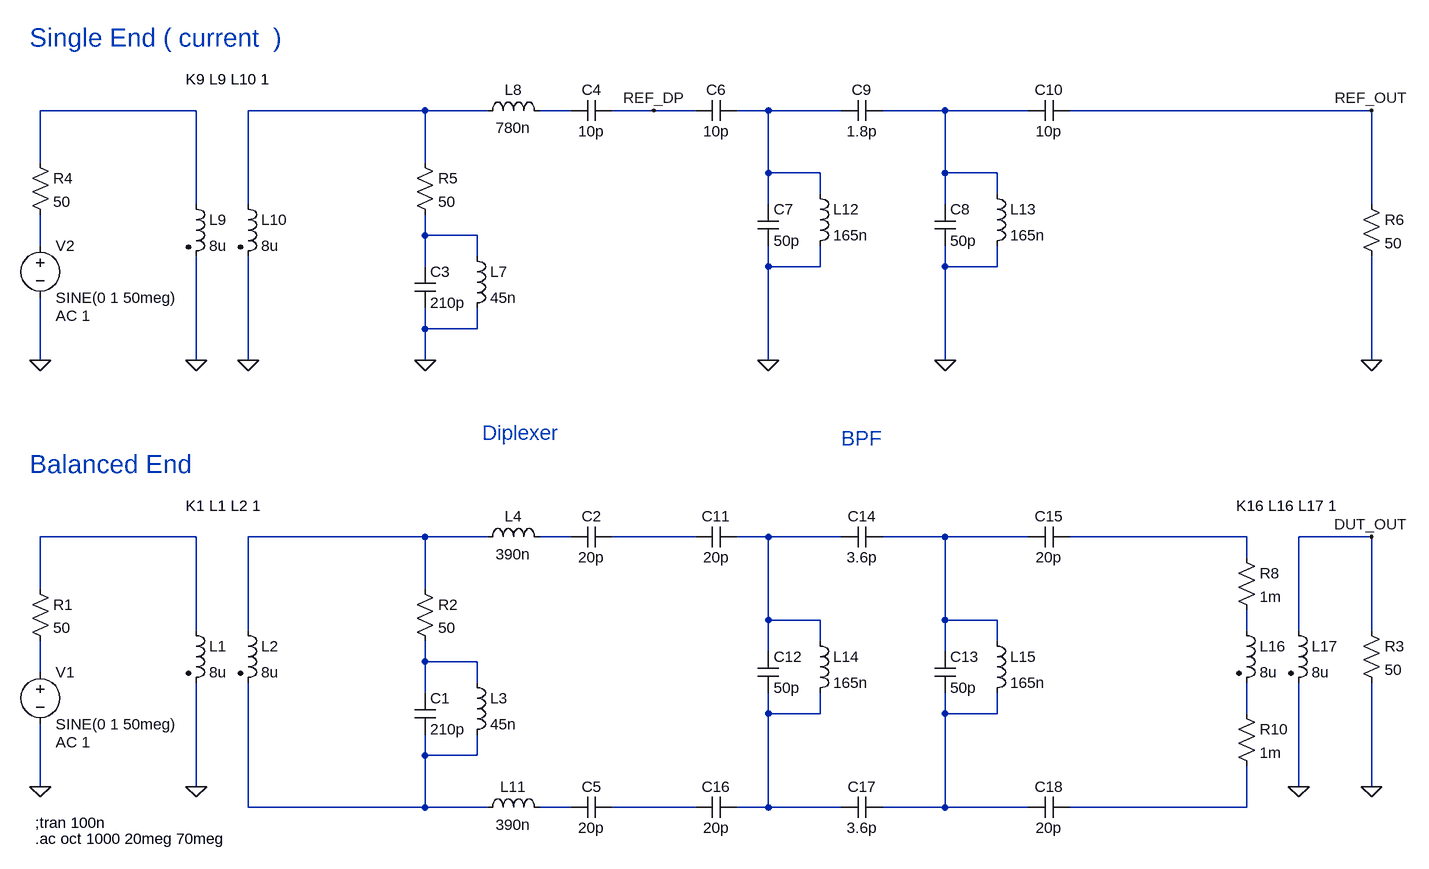
[diagram p0: schematic balanced_6m_filter.asc]
balanced_6m_filter.asc, the LTspice schematic file:
Version 4
SHEET 1 2068 1696
WIRE 160 560 -80 560
WIRE 512 560 240 560
WIRE 608 560 512 560
WIRE 736 560 688 560
WIRE 864 560 800 560
WIRE 928 560 864 560
WIRE 1040 560 992 560
WIRE 1152 560 1040 560
WIRE 1312 560 1216 560
WIRE 1440 560 1312 560
WIRE 1968 560 1504 560
WIRE -80 640 -80 560
WIRE 512 640 512 560
WIRE 1040 656 1040 560
WIRE 1120 656 1040 656
WIRE 1312 656 1312 560
WIRE 1392 656 1312 656
WIRE 1120 688 1120 656
WIRE 1392 688 1392 656
WIRE 160 704 160 560
WIRE 240 704 240 560
WIRE 1040 704 1040 656
WIRE 1312 704 1312 656
WIRE 1968 704 1968 560
WIRE 512 752 512 720
WIRE 592 752 512 752
WIRE -80 768 -80 720
WIRE 592 784 592 752
WIRE 512 800 512 752
WIRE 1040 800 1040 768
WIRE 1120 800 1120 768
WIRE 1120 800 1040 800
WIRE 1312 800 1312 768
WIRE 1392 800 1392 768
WIRE 1392 800 1312 800
WIRE 512 896 512 864
WIRE 592 896 592 864
WIRE 592 896 512 896
WIRE -80 944 -80 848
WIRE 160 944 160 784
WIRE 240 944 240 784
WIRE 512 944 512 896
WIRE 1040 944 1040 800
WIRE 1312 944 1312 800
WIRE 1968 944 1968 784
WIRE 160 1216 -80 1216
WIRE 512 1216 240 1216
WIRE 608 1216 512 1216
WIRE 736 1216 688 1216
WIRE 928 1216 800 1216
WIRE 1040 1216 992 1216
WIRE 1152 1216 1040 1216
WIRE 1312 1216 1216 1216
WIRE 1440 1216 1312 1216
WIRE 1776 1216 1504 1216
WIRE 1968 1216 1856 1216
WIRE 1776 1248 1776 1216
WIRE -80 1296 -80 1216
WIRE 512 1296 512 1216
WIRE 1040 1344 1040 1216
WIRE 1120 1344 1040 1344
WIRE 1312 1344 1312 1216
WIRE 1392 1344 1312 1344
WIRE 160 1360 160 1216
WIRE 240 1360 240 1216
WIRE 1776 1360 1776 1328
WIRE 1856 1360 1856 1216
WIRE 1968 1360 1968 1216
WIRE 1120 1376 1120 1344
WIRE 1392 1376 1392 1344
WIRE 1040 1392 1040 1344
WIRE 1312 1392 1312 1344
WIRE 512 1408 512 1376
WIRE 592 1408 512 1408
WIRE -80 1424 -80 1376
WIRE 592 1440 592 1408
WIRE 512 1456 512 1408
WIRE 1040 1488 1040 1456
WIRE 1120 1488 1120 1456
WIRE 1120 1488 1040 1488
WIRE 1312 1488 1312 1456
WIRE 1392 1488 1392 1456
WIRE 1392 1488 1312 1488
WIRE 1776 1488 1776 1440
WIRE 512 1552 512 1520
WIRE 592 1552 592 1520
WIRE 592 1552 512 1552
WIRE -80 1600 -80 1504
WIRE 160 1600 160 1440
WIRE 1856 1600 1856 1440
WIRE 1968 1600 1968 1440
WIRE 240 1632 240 1440
WIRE 512 1632 512 1552
WIRE 512 1632 240 1632
WIRE 608 1632 512 1632
WIRE 736 1632 688 1632
WIRE 928 1632 800 1632
WIRE 1040 1632 1040 1488
WIRE 1040 1632 992 1632
WIRE 1152 1632 1040 1632
WIRE 1312 1632 1312 1488
WIRE 1312 1632 1216 1632
WIRE 1440 1632 1312 1632
WIRE 1776 1632 1776 1568
WIRE 1776 1632 1504 1632
FLAG 160 1600 0
FLAG -80 1600 0
FLAG 1968 1600 0
FLAG -80 944 0
FLAG 512 944 0
FLAG 1968 944 0
FLAG 160 944 0
FLAG 240 944 0
FLAG 1968 560 REF_OUT
FLAG 1968 1216 DUT_OUT
FLAG 1040 944 0
FLAG 1312 944 0
FLAG 864 560 REF_DP
FLAG 1856 1600 0
SYMBOL voltage -80 1408 R0
WINDOW 123 24 124 Left 2
WINDOW 39 0 0 Left 2
SYMATTR Value2 AC 1
SYMATTR InstName V1
SYMATTR Value SINE(0 1 50meg)
SYMBOL res -96 1280 R0
SYMATTR InstName R1
SYMATTR Value 50
SYMBOL ind2 144 1344 R0
SYMATTR InstName L1
SYMATTR Value 8u
SYMATTR Type ind
SYMBOL ind2 224 1344 R0
SYMATTR InstName L2
SYMATTR Value 8u
SYMATTR Type ind
SYMBOL res 496 1280 R0
SYMATTR InstName R2
SYMATTR Value 50
SYMBOL cap 496 1456 R0
SYMATTR InstName C1
SYMATTR Value 210p
SYMBOL ind 576 1424 R0
SYMATTR InstName L3
SYMATTR Value 45n
SYMBOL ind 592 1232 R270
WINDOW 0 32 56 VTop 2
WINDOW 3 5 56 VBottom 2
SYMATTR InstName L4
SYMATTR Value 390n
SYMBOL cap 736 1232 R270
WINDOW 0 32 32 VTop 2
WINDOW 3 0 32 VBottom 2
SYMATTR InstName C2
SYMATTR Value 20p
SYMBOL res 1952 1344 R0
SYMATTR InstName R3
SYMATTR Value 50
SYMBOL voltage -80 752 R0
WINDOW 123 24 124 Left 2
WINDOW 39 0 0 Left 2
SYMATTR Value2 AC 1
SYMATTR InstName V2
SYMATTR Value SINE(0 1 50meg)
SYMBOL res -96 624 R0
SYMATTR InstName R4
SYMATTR Value 50
SYMBOL res 496 624 R0
SYMATTR InstName R5
SYMATTR Value 50
SYMBOL cap 496 800 R0
SYMATTR InstName C3
SYMATTR Value 210p
SYMBOL ind 576 768 R0
SYMATTR InstName L7
SYMATTR Value 45n
SYMBOL ind 592 576 R270
WINDOW 0 32 56 VTop 2
WINDOW 3 5 56 VBottom 2
SYMATTR InstName L8
SYMATTR Value 780n
SYMBOL cap 736 576 R270
WINDOW 0 32 32 VTop 2
WINDOW 3 0 32 VBottom 2
SYMATTR InstName C4
SYMATTR Value 10p
SYMBOL res 1952 688 R0
SYMATTR InstName R6
SYMATTR Value 50
SYMBOL ind2 144 688 R0
SYMATTR InstName L9
SYMATTR Value 8u
SYMATTR Type ind
SYMBOL ind2 224 688 R0
SYMATTR InstName L10
SYMATTR Value 8u
SYMATTR Type ind
SYMBOL ind 592 1648 R270
WINDOW 0 32 56 VTop 2
WINDOW 3 5 56 VBottom 2
SYMATTR InstName L11
SYMATTR Value 390n
SYMBOL cap 736 1648 R270
WINDOW 0 32 32 VTop 2
WINDOW 3 0 32 VBottom 2
SYMATTR InstName C5
SYMATTR Value 20p
SYMBOL cap 928 576 R270
WINDOW 0 32 32 VTop 2
WINDOW 3 0 32 VBottom 2
SYMATTR InstName C6
SYMATTR Value 10p
SYMBOL cap 1024 704 R0
SYMATTR InstName C7
SYMATTR Value 50p
SYMBOL ind 1104 672 R0
SYMATTR InstName L12
SYMATTR Value 165n
SYMBOL cap 1296 704 R0
SYMATTR InstName C8
SYMATTR Value 50p
SYMBOL ind 1376 672 R0
SYMATTR InstName L13
SYMATTR Value 165n
SYMBOL cap 1152 576 R270
WINDOW 0 32 32 VTop 2
WINDOW 3 0 32 VBottom 2
SYMATTR InstName C9
SYMATTR Value 1.8p
SYMBOL cap 1440 576 R270
WINDOW 0 32 32 VTop 2
WINDOW 3 0 32 VBottom 2
SYMATTR InstName C10
SYMATTR Value 10p
SYMBOL cap 928 1232 R270
WINDOW 0 32 32 VTop 2
WINDOW 3 0 32 VBottom 2
SYMATTR InstName C11
SYMATTR Value 20p
SYMBOL cap 1024 1392 R0
SYMATTR InstName C12
SYMATTR Value 50p
SYMBOL ind 1104 1360 R0
SYMATTR InstName L14
SYMATTR Value 165n
SYMBOL cap 1296 1392 R0
SYMATTR InstName C13
SYMATTR Value 50p
SYMBOL ind 1376 1360 R0
SYMATTR InstName L15
SYMATTR Value 165n
SYMBOL cap 1152 1232 R270
WINDOW 0 32 32 VTop 2
WINDOW 3 0 32 VBottom 2
SYMATTR InstName C14
SYMATTR Value 3.6p
SYMBOL cap 1440 1232 R270
WINDOW 0 32 32 VTop 2
WINDOW 3 0 32 VBottom 2
SYMATTR InstName C15
SYMATTR Value 20p
SYMBOL cap 928 1648 R270
WINDOW 0 32 32 VTop 2
WINDOW 3 0 32 VBottom 2
SYMATTR InstName C16
SYMATTR Value 20p
SYMBOL cap 1152 1648 R270
WINDOW 0 32 32 VTop 2
WINDOW 3 0 32 VBottom 2
SYMATTR InstName C17
SYMATTR Value 3.6p
SYMBOL cap 1440 1648 R270
WINDOW 0 32 32 VTop 2
WINDOW 3 0 32 VBottom 2
SYMATTR InstName C18
SYMATTR Value 20p
SYMBOL ind2 1760 1344 R0
SYMATTR InstName L16
SYMATTR Value 8u
SYMATTR Type ind
SYMBOL ind2 1840 1344 R0
SYMATTR InstName L17
SYMATTR Value 8u
SYMATTR Type ind
SYMBOL res 1760 1232 R0
SYMATTR InstName R8
SYMATTR Value 1m
SYMBOL res 1760 1472 R0
SYMATTR InstName R10
SYMATTR Value 1m
TEXT 144 1168 Left 2 !K1 L1 L2 1
TEXT -88 1656 Left 2 !;tran 100n
TEXT -88 1680 Left 2 !.ac oct 1000 20meg 70meg
TEXT 144 512 Left 2 !K9 L9 L10 1
TEXT 1760 1168 Left 2 !K16 L16 L17 1
TEXT 600 1056 Left 3 ;Diplexer
TEXT 1152 1064 Left 3 ;BPF
TEXT -96 448 Left 4 ;Single End ( current  )
TEXT -96 1104 Left 4 ;Balanced End

The netlist it stands for:
* balanced_6m_filter.asc
V1 N017 0 SINE(0 1 50meg) AC 1
R1 N008 N017 50
L1 N008 0 8u
L2 N009 N021 8u
R2 N009 N016 50
C1 N016 N021 210p
L3 N016 N021 45n
L4 N009 N010 390n
C2 N010 N011 20p
R3 DUT_OUT 0 50
V2 N007 0 SINE(0 1 50meg) AC 1
R4 N001 N007 50
R5 N002 N006 50
C3 N006 0 210p
L7 N006 0 45n
L8 N002 N003 780n
C4 N003 REF_DP 10p
R6 REF_OUT 0 50
L9 N001 0 8u
L10 N002 0 8u
L11 N021 N022 390n
C5 N022 N023 20p
C6 REF_DP N004 10p
C7 N004 0 50p
L12 N004 0 165n
C8 N005 0 50p
L13 N005 0 165n
C9 N004 N005 1.8p
C10 N005 REF_OUT 10p
C11 N011 N012 20p
C12 N012 N018 50p
L14 N012 N018 165n
C13 N013 N019 50p
L15 N013 N019 165n
C14 N012 N013 3.6p
C15 N013 N014 20p
C16 N023 N018 20p
C17 N018 N019 3.6p
C18 N019 N024 20p
L16 N015 N020 8u
L17 DUT_OUT 0 8u
R8 N014 N015 1m
R10 N020 N024 1m
K1 L1 L2 1
;tran 100n
.ac oct 1000 20meg 70meg
K9 L9 L10 1
K16 L16 L17 1
* Diplexer
* BPF
* Single End ( current  )
* Balanced End
.backanno
.end